# Altium schematic sheet QUAD_BUCK.SchDoc: Sayma AMC
size 420 x 297 mm; CheckedBy: P.Kulik,T.Przywozki,W.Ruclo; Author: G.Kasprowicz; CompanyName: WUT ISE; DrawnBy: G.Kasprowicz; Organization: WUT ISE; Address1: PW ISE; Address2: Nowowiejska 15/19 00-665 Warsaw; Address3: gkasprow@gmail.com; DocumentNumber: 15; Revision: 2; SheetNumber: 15; SheetTotal: 32; ModifiedBy: -; CheckedDate: -; Title2: Quad buck converter; DivGrp: WUT ISE; Designer: G.Kasprowicz; ModifiedDate: -; ProjectName: Sensor Box
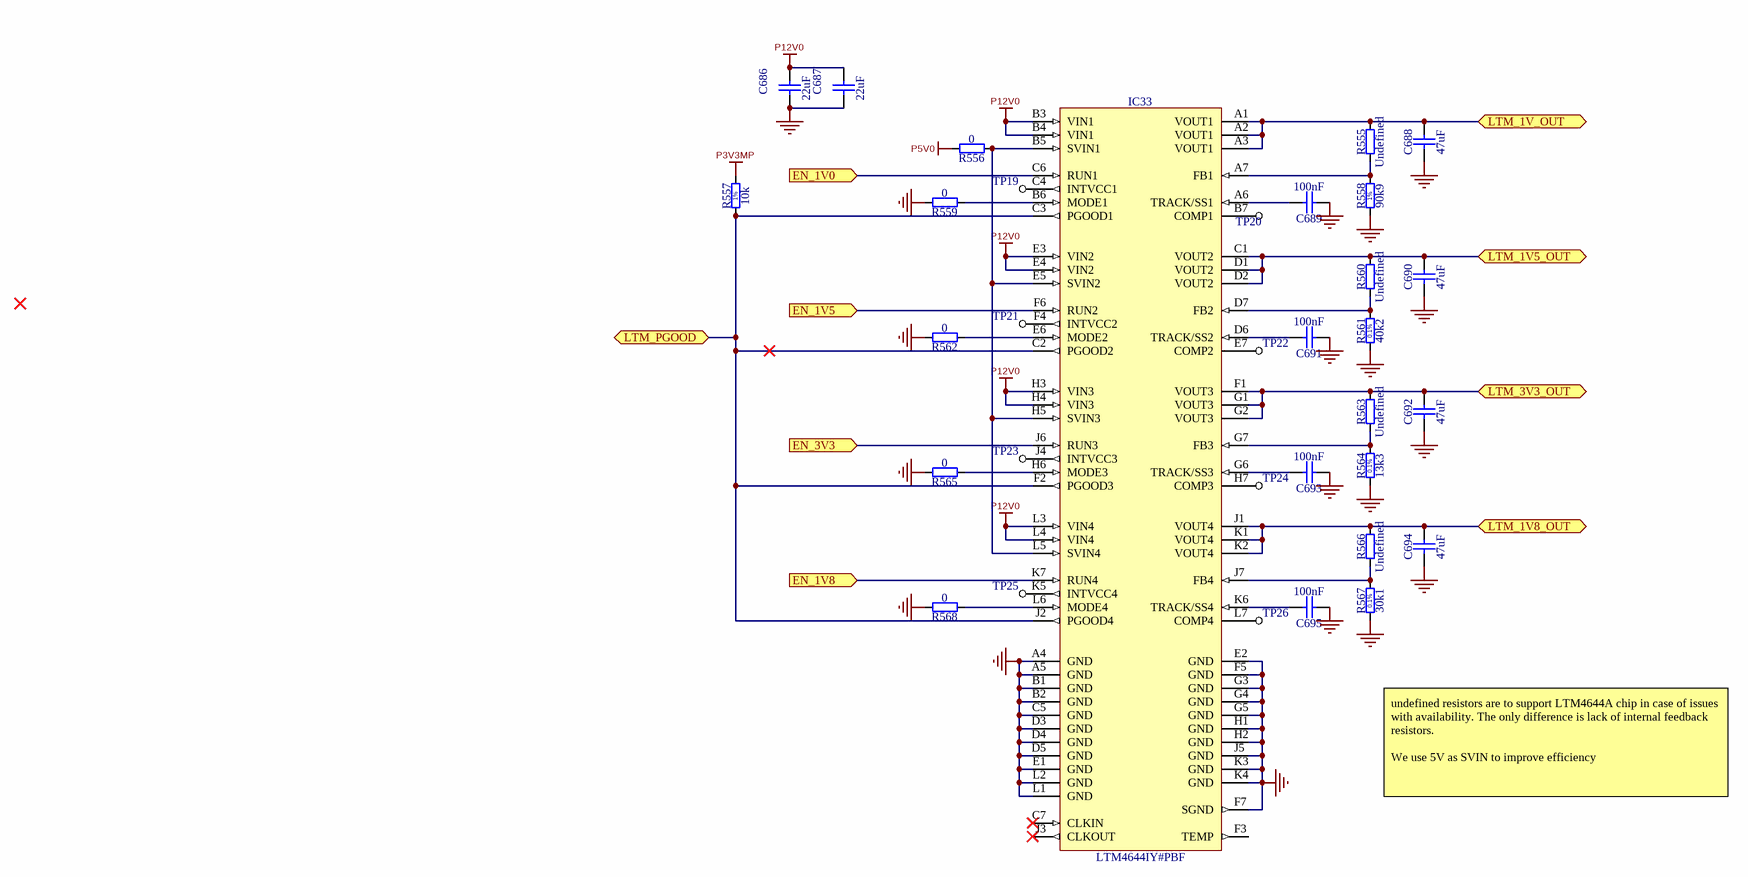
[diagram p0: QUAD_BUCK.SchDoc]

## Parts
C686  22uF  [CAPC2012X135N]
C687  22uF  [CAPC2012X135N]
C688  47uF  [CAPC2012X140N]
C689  100nF  [CAPC1005X55N]
C690  47uF  [CAPC2012X140N]
C691  100nF  [CAPC1005X55N]
C692  47uF  [CAPC2012X140N]
C693  100nF  [CAPC1005X55N]
C694  47uF  [CAPC2012X140N]
C695  100nF  [CAPC1005X55N]
IC33  LTM4644IY#PBF  [BGA77C127P7X11_900X1500X521]
R555  Undefined  [RESC1608X55N]
R556  0  [RESC1005X40N]
R557  10k  [RESC1005X40N]
R558  90k9  [RESC1608X55N]
R559  0  [RESC1005X40N]
R560  Undefined  [RESC1608X55N]
R561  40k2  [RESC1608X55N]
R562  0  [RESC1005X40N]
R563  Undefined  [RESC1608X55N]
R564  13k3  [RESC1608X55N]
R565  0  [RESC1005X40N]
R566  Undefined  [RESC1608X55N]
R567  30k1  [RESC1608X55N]
R568  0  [RESC1005X40N]
TP19  TP  [TP]  (value not drawn)
TP20  TP  [TP]  (value not drawn)
TP21  TP  [TP]  (value not drawn)
TP22  TP  [TP]  (value not drawn)
TP23  TP  [TP]  (value not drawn)
TP24  TP  [TP]  (value not drawn)
TP25  TP  [TP]  (value not drawn)
TP26  TP  [TP]  (value not drawn)

## Ports
EN_1V0 (in), EN_1V5 (in), EN_1V8 (in), EN_3V3 (in), LTM_1V5_OUT (bidir), LTM_1V8_OUT (bidir), LTM_1V_OUT (bidir), LTM_3V3_OUT (bidir), LTM_PGOOD (bidir)

## Nets
GND: C686.1 C687.1 C688.1 C689.1 C690.1 C691.1 C692.1 C693.1 C694.1 C695.1 IC33.A4(GND) IC33.A5(GND) IC33.B1(GND) IC33.B2(GND) IC33.C5(GND) IC33.D3(GND) IC33.D4(GND) IC33.D5(GND) IC33.E1(GND) IC33.E2(GND) IC33.F5(GND) IC33.F7(SGND) IC33.G3(GND) IC33.G4(GND) IC33.G5(GND) IC33.H1(GND) IC33.H2(GND) IC33.J5(GND) IC33.K3(GND) IC33.K4(GND) IC33.L1(GND) IC33.L2(GND) R558.1 R559.2 R561.1 R562.2 R564.1 R565.2 R567.1 R568.2
P3V3MP: R557.2
P5V0: R556.2
P12V0: C686.2 C687.2 IC33.B3(VIN1) IC33.B4(VIN1) IC33.E3(VIN2) IC33.E4(VIN2) IC33.H3(VIN3) IC33.H4(VIN3) IC33.L3(VIN4) IC33.L4(VIN4)
EN_1V0: IC33.C6(RUN1) ; port EN_1V0
EN_1V5: IC33.F6(RUN2) ; port EN_1V5
EN_1V8: IC33.K7(RUN4) ; port EN_1V8
EN_3V3: IC33.J6(RUN3) ; port EN_3V3
LTM_1V5_OUT: C690.2 IC33.C1(VOUT2) IC33.D1(VOUT2) IC33.D2(VOUT2) R560.2 ; port LTM_1V5_OUT
LTM_1V8_OUT: C694.2 IC33.J1(VOUT4) IC33.K1(VOUT4) IC33.K2(VOUT4) R566.2 ; port LTM_1V8_OUT
LTM_1V_OUT: C688.2 IC33.A1(VOUT1) IC33.A2(VOUT1) IC33.A3(VOUT1) R555.2 ; port LTM_1V_OUT
LTM_3V3_OUT: C692.2 IC33.F1(VOUT3) IC33.G1(VOUT3) IC33.G2(VOUT3) R563.2 ; port LTM_3V3_OUT
LTM_PGOOD: IC33.C2(PGOOD2) IC33.C3(PGOOD1) IC33.F2(PGOOD3) IC33.J2(PGOOD4) R557.1 ; port LTM_PGOOD
NetC689_2: C689.2 IC33.A6(TRACK/SS1)
NetC691_2: C691.2 IC33.D6(TRACK/SS2)
NetC693_2: C693.2 IC33.G6(TRACK/SS3)
NetC695_2: C695.2 IC33.K6(TRACK/SS4)
NetIC33_A7: IC33.A7(FB1) R555.1 R558.2
NetIC33_B5: IC33.B5(SVIN1) IC33.E5(SVIN2) IC33.H5(SVIN3) IC33.L5(SVIN4) R556.1
NetIC33_B6: IC33.B6(MODE1) R559.1
NetIC33_B7: IC33.B7(COMP1) TP20.1
NetIC33_C4: IC33.C4(INTVCC1) TP19.1
NetIC33_D7: IC33.D7(FB2) R560.1 R561.2
NetIC33_E6: IC33.E6(MODE2) R562.1
NetIC33_E7: IC33.E7(COMP2) TP22.1
NetIC33_F4: IC33.F4(INTVCC2) TP21.1
NetIC33_G7: IC33.G7(FB3) R563.1 R564.2
NetIC33_H6: IC33.H6(MODE3) R565.1
NetIC33_H7: IC33.H7(COMP3) TP24.1
NetIC33_J4: IC33.J4(INTVCC3) TP23.1
NetIC33_J7: IC33.J7(FB4) R566.1 R567.2
NetIC33_K5: IC33.K5(INTVCC4) TP25.1
NetIC33_L6: IC33.L6(MODE4) R568.1
NetIC33_L7: IC33.L7(COMP4) TP26.1

Not connected (* = marked no-connect by the designer): IC33 C7(CLKIN)* F3(TEMP) J3(CLKOUT)*

## Notes on the sheet
- undefined resistors are to support LTM4644A chip in case of issues with availability. The only difference is lack of internal feedback resistors.
  We use 5V as SVIN to improve efficiency
- Project/Equipment
- Document
- Designer
- Drawn by
- Check.by
- Copyright WUT ISE 2018.
  This documentation describes Open Hardware and is licensed under the CERN OHL v.1.1. You may redistribute and modify this documentation under the terms of the CERN OHL v.1.1. (http://ohwr.org/CERNOHL). This documentation is distributed WITHOUT ANY EXPRESS OR IMPLIED WARRANTY, INCLUDING OF MERCHANTABILITY, SATISFACTORY QUALITY AND FITNESS FOR A PARTICULAR PURPOSE. Please see the CERN OHL v.1.1 for applicable conditions.
- Contact
- File
- Last Mod.
- Print Date
- Sheet
- Size
- A3
- of
- Rev
- (in symbol R0402_10K_1%_0.0625W_100PPM) 1%
- (in symbol R0603_13K3_0.1%_0.063W_10PPM) 0.1%
- (in symbol R0603_30K1_0.1%_0.063W_10PPM) 0.1%
- (in symbol R0603_40K2_0.1%_0.063W_10PPM) 0.1%
- (in symbol R0603_90K9_1%_0.1W_100PPM) 1%

## Library data of the parts
C686 C687 = CC0805_22UF_16V_10%_X5R: Non-polarised capacitor; Manufacturer: GENERIC; Part Description: SMD Multilayer Chip Ceramic Capacitor; Manufacturer1 Part Number: C2012X5R1C226KT; Tolerance: ±10%; Voltage: 16V; TC: X5R; Manufacturer Part Number: CC0805_22UF_16V_10%_X5R; Part Number: CC0805_22UF_16V_10%_X5R; Value: 22uF; Component Kind: Standard; Component Type: Standard; Pin Count: 2; Status: Preferred; Case: 0805; Mounted: Yes; Socket: No; SMD: Yes; Sense: No; Manufacturer1 Example: TDK; Manufacturer1 ComponentHeight: 1.35mm; HelpURL: \\cern.ch\dfs\Applications\Altium\Datasheets\CC0805_X5R_TDK_C.pdf; Author: CERN DEM JLC; CreateDate: 25.10.2012; LatestRevisionDate: 25.10.2012
C688 C690 C692 C694 = CC0805_47UF_6.3V_20%_X5R: Non-polarised capacitor; Manufacturer: GENERIC; Part Description: SMD Multilayer Chip Ceramic Capacitor; Manufacturer1 Part Number: C0805C476M9PACTU; Tolerance: ±20%; Voltage: 6.3V; TC: X5R; Manufacturer Part Number: CC0805_47UF_6.3V_20%_X5R; Part Number: CC0805_47UF_6.3V_20%_X5R; Value: 47uF; Component Kind: Standard; Component Type: Standard; Pin Count: 2; Status: Preferred; Case: 0805; Mounted: Yes; Socket: No; SMD: Yes; Sense: No; Manufacturer1 Example: KEMET; Manufacturer1 ComponentHeight: 1.4mm; HelpURL: \\cern.ch\dfs\Applications\Altium\Datasheets\CC0805_X5R_KEMET.pdf; Author: CERN DEM JLC; CreateDate: 16.10.2012; LatestRevisionDate: 16.10.2012
C689 C691 C693 C695 = CC0402_100NF_16V_10%_X5R: Non-polarised capacitor; Part Description: SMD Multilayer Chip Ceramic Capacitor; Manufacturer: GENERIC; Manufacturer1 Part Number: GRM155R61C104KA88D; Voltage: 16V; TC: X5R; Tolerance: ±10%; Part Number: CC0402_100NF_16V_10%_X5R; Component Kind: Standard; Component Type: Standard; Pin Count: 2; Value: 100nF; Status: None; Manufacturer Part Number: CC0402_100NF_16V_10%_X5R; Case: 0402; Mounted: Yes; Socket: No; SMD: Yes; Sense: No; Manufacturer1 Example: MURATA; Manufacturer1 ComponentHeight: 0.55mm; HelpURL: \\cern.ch\dfs\Applications\Altium\Datasheets\CC0402_X5R_MURATA_GRM.pdf; Author: CERN DEM JLC; CreateDate: 10.12.2013; LatestRevisionDate: 10.12.2013
IC33 = LTM4644IY#PBF: Quad DC/DC µModule Regulator with Configurable 4A Output Array; Part Description: 4V-14V to 0.6V-5.5V Quad DC/DC uModule (Power Module) Regulator with Configurable 4A Output Array; Manufacturer: LINEAR TECHNOLOGY; PressFit: No; Bonding: No; Part Number: LTM4644IY#PBF; Component Kind: Standard; Component Type: Standard; Device: LTM4644IY#PBF; PackageDescription: BGA, 1.27mm Pitch, Rect.; 77 Pin, 7 Columns X 11 Rows, 9.00mm X 15.00mm X 5.21mm H; Manufacturer Part Number: LTM4644IY#PBF; Pin Count: 77; Case: BGA77; Mounted: Yes; Socket: No; SMD: Yes; Sense: No; ComponentHeight: 5.21mm; HelpURL: \\cern.ch\dfs\Applications\Altium\Datasheets\LTM4644IY#PBF.pdf; Author: CERN DEM JLC; CreateDate: 25.04.2018; LatestRevisionDate: 25.04.2018
R555 R560 R563 R566 = R0603_NO-VALUE: Resistor; Part Description: Reserved Footprint For a 0603 (1608) Chip Resistor; PressFit: No; Mounted: No; Part Number: R0603_NO-VALUE; Component Kind: Standard; Component Type: Standard; Pin Count: 2; Value: Undefined; Status: None; Manufacturer: Undefined; Manufacturer Part Number: R0603_NO-VALUE; Case: 0603; Sense: No; Socket: No; SMD: Yes; Manufacturer1 Example: Undefined; Manufacturer1 Part Number: Undefined; Manufacturer1 ComponentHeight: Undefined; HelpURL: Undefined; Author: CERN DEM JLC; CreateDate: 03.12.2007; LatestRevisionDate: 13.03.2008
R556 R559 R562 R565 R568 = R0402_0R_JUMPER: Resistor; Manufacturer: GENERIC; Part Description: 1A (0.05R Max DC Resistance) Zero Ohm Jumper; Manufacturer1 Part Number: 232270591001L; PressFit: No; Manufacturer Part Number: R0402_0R_JUMPER; Part Number: R0402_0R_JUMPER; Value: 0; Component Kind: Standard; Component Type: Standard; Pin Count: 2; Status: Not Recommended; Case: 0402; Mounted: Yes; Sense: No; Socket: No; SMD: Yes; Manufacturer1 Example: YAGEO PHYCOMP; Manufacturer1 ComponentHeight: 0.4mm; HelpURL: \\cern.ch\dfs\Applications\Altium\Datasheets\R0402_Phycomp_RC0402.pdf; Author: CERN DEM JLC; CreateDate: 03.12.2007; LatestRevisionDate: 17.10.2012
R557 = R0402_10K_1%_0.0625W_100PPM: Resistor - 1%; Manufacturer: GENERIC; Part Description: General Purpose Thick Film Chip Resistor; Manufacturer1 Part Number: 232270671003L; TC: ±100ppm/°C; PressFit: No; Manufacturer Part Number: R0402_10K_1%_0.0625W_100PPM; Part Number: R0402_10K_1%_0.0625W_100PPM; Tolerance: ±1%; Value: 10k; Component Kind: Standard; Component Type: Standard; Pin Count: 2; Status: Not Recommended; Power: 0.0625W; Case: 0402; Mounted: Yes; Sense: No; Socket: No; SMD: Yes; Manufacturer1 Example: YAGEO PHYCOMP; Manufacturer1 ComponentHeight: 0.4mm; HelpURL: \\cern.ch\dfs\Applications\Altium\Datasheets\R0402_Phycomp_RC0402.pdf; Author: CERN DEM JLC; CreateDate: 03.12.2007; LatestRevisionDate: 17.10.2012
R558 = R0603_90K9_1%_0.1W_100PPM: Resistor - 1%; Part Description: General Purpose Thick Film Chip Resistor; Manufacturer: GENERIC; Manufacturer1 Part Number: CRCW060390K9FKEA; Power: 0.1W; TC: ±100ppm/°C; PressFit: No; Part Number: R0603_90K9_1%_0.1W_100PPM; Component Kind: Standard; Component Type: Standard; Pin Count: 2; Value: 90k9; Status: Preferred; Tolerance: ±1%; Manufacturer Part Number: R0603_90K9_1%_0.1W_100PPM; Case: 0603; Mounted: Yes; Sense: No; Socket: No; SMD: Yes; Manufacturer1 Example: VISHAY; Manufacturer1 ComponentHeight: 0.55mm; HelpURL: \\cern.ch\dfs\Applications\Altium\Datasheets\R0603_VISHAY_CRCW e3.pdf; Author: CERN DEM JLC; CreateDate: 14.03.2018; LatestRevisionDate: 14.03.2018
R561 = R0603_40K2_0.1%_0.063W_10PPM: Resistor - 0.1%; Part Description: Thin Film Chip Resistor; Manufacturer: GENERIC; Manufacturer1 Part Number: RN73C1J40K2BTDF; Power: 0.063W; TC: ±10ppm; PressFit: No; Part Number: R0603_40K2_0.1%_0.063W_10PPM; Component Kind: Standard; Component Type: Standard; Pin Count: 2; Value: 40k2; Status: Not Recommended; Tolerance: ±0.1%; Manufacturer Part Number: R0603_40K2_0.1%_0.063W_10PPM; Case: 0603; Mounted: Yes; Sense: No; Socket: No; SMD: Yes; Manufacturer1 Example: TYCO HOLSWORTHY; Manufacturer1 ComponentHeight: 0.5mm; HelpURL: \\cern.ch\dfs\Applications\Altium\Datasheets\R0603_Tyco_RN73.pdf; Author: CERN DEM JLC; CreateDate: 03.12.2007; LatestRevisionDate: 13.03.2008
R564 = R0603_13K3_0.1%_0.063W_10PPM: Resistor - 0.1%; Part Description: Thin Film Chip Resistor; Manufacturer: GENERIC; Manufacturer1 Part Number: RN73C1J13K3BTDF; Power: 0.063W; TC: ±10ppm; PressFit: No; Part Number: R0603_13K3_0.1%_0.063W_10PPM; Component Kind: Standard; Component Type: Standard; Pin Count: 2; Value: 13k3; Status: Not Recommended; Tolerance: ±0.1%; Manufacturer Part Number: R0603_13K3_0.1%_0.063W_10PPM; Case: 0603; Mounted: Yes; Sense: No; Socket: No; SMD: Yes; Manufacturer1 Example: TYCO HOLSWORTHY; Manufacturer1 ComponentHeight: 0.5mm; HelpURL: \\cern.ch\dfs\Applications\Altium\Datasheets\R0603_Tyco_RN73.pdf; Author: CERN DEM JLC; CreateDate: 03.12.2007; LatestRevisionDate: 13.03.2008
R567 = R0603_30K1_0.1%_0.063W_10PPM: Resistor - 0.1%; Part Description: Thin Film Chip Resistor; Manufacturer: GENERIC; Manufacturer1 Part Number: RN73C1J30K1BTDF; Power: 0.063W; TC: ±10ppm; PressFit: No; Part Number: R0603_30K1_0.1%_0.063W_10PPM; Component Kind: Standard; Component Type: Standard; Pin Count: 2; Value: 30k1; Status: Not Recommended; Tolerance: ±0.1%; Manufacturer Part Number: R0603_30K1_0.1%_0.063W_10PPM; Case: 0603; Mounted: Yes; Sense: No; Socket: No; SMD: Yes; Manufacturer1 Example: TYCO HOLSWORTHY; Manufacturer1 ComponentHeight: 0.5mm; HelpURL: \\cern.ch\dfs\Applications\Altium\Datasheets\R0603_Tyco_RN73.pdf; Author: CERN DEM JLC; CreateDate: 03.12.2007; LatestRevisionDate: 13.03.2008
TP19-TP26 = TP: Testpoint